# EasyEDA Pro project ProPrj_Smart_security_2024-12-20.epro

# Schematic Schematic1
Board Name: Board1; Create Date: 2024-12-19
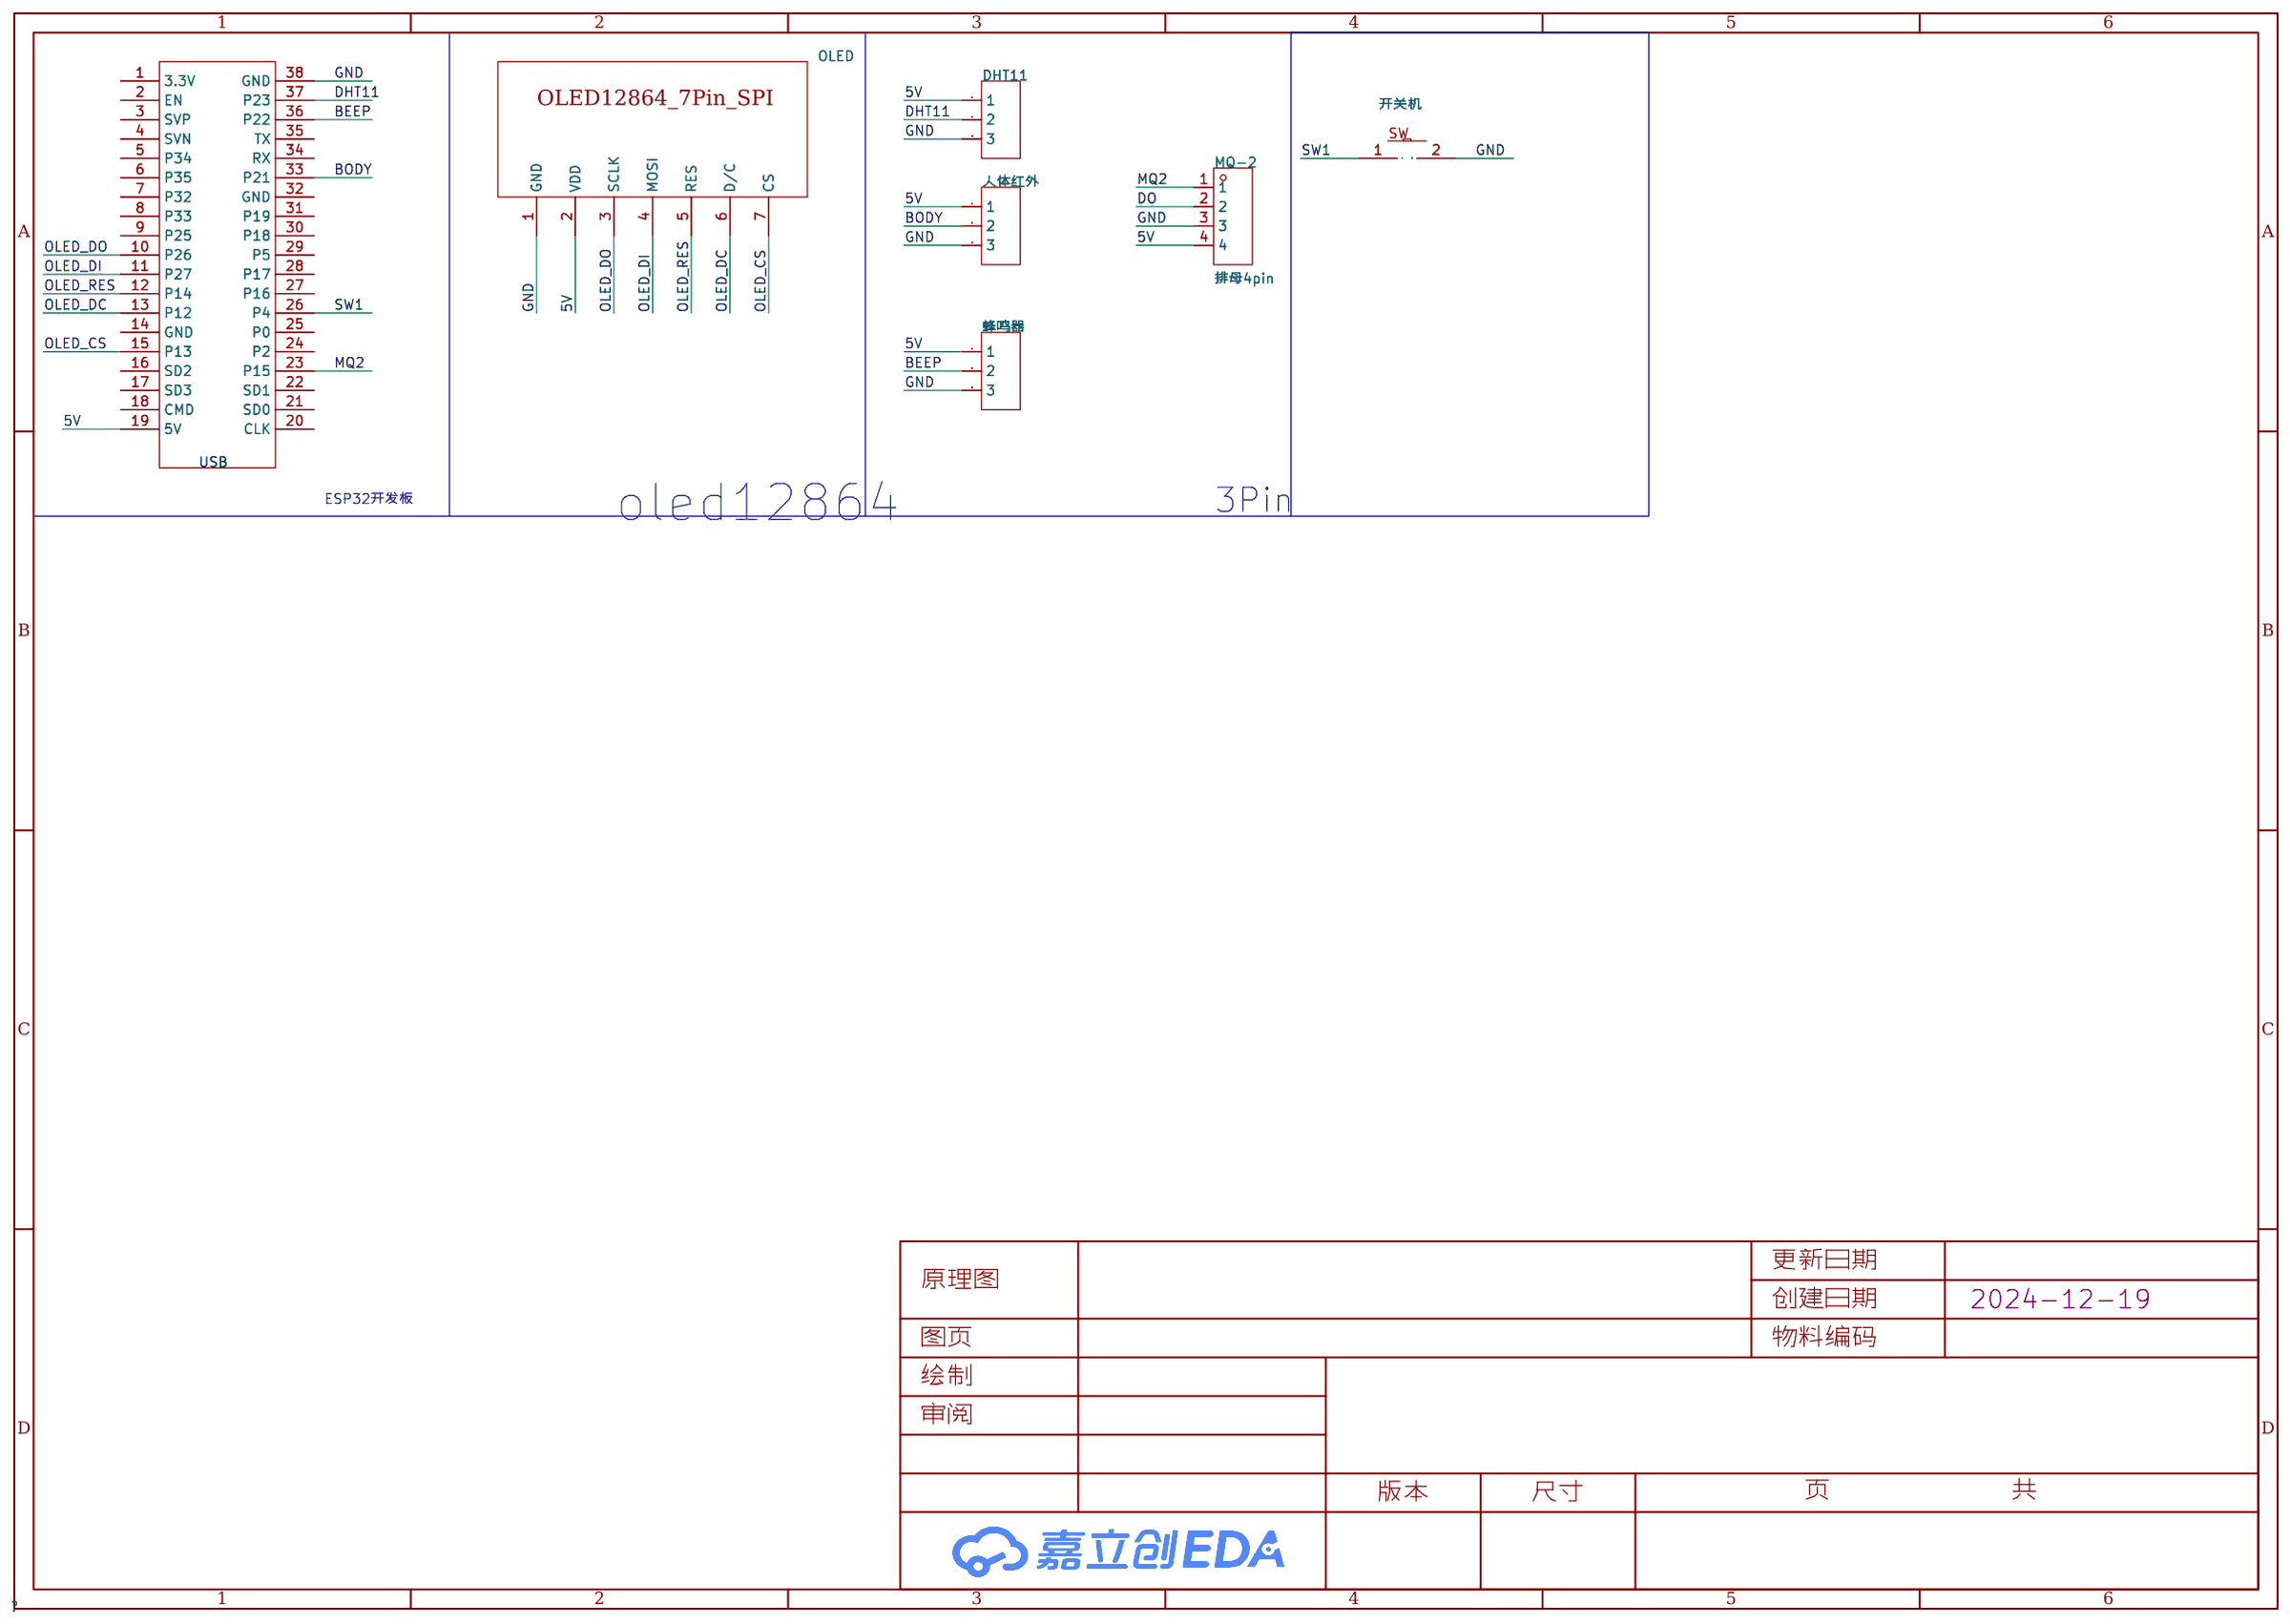
[diagram p0: schematic sheet]

## Parts
DHT11  DHT11  [HDR-F-2.54_1X3]
ESP32_38PIN_1  -  [ESP32_38PIN教学]
MQ-2  排母4pin  [排母4PIN]
OLED  OLED12864_7Pin_SPI  [OLED-12864(7PIN-SPI)]
人体红外  人体红外  [HDR-F-2.54_1X3]
开关机  -  [pb]
蜂鸣器  蜂鸣器  [HDR-F-2.54_1X3]

## Library data of the parts
DHT11 人体红外 蜂鸣器 = 排母3PIN: 3DModel: HDR-F-2.54_1x3; link: https://www.cjt.com/Upload/A2541.pdf; Supplier Part: C146690; Supplier: LCSC
ESP32_38PIN_1 = ESP32_38PIN
MQ-2 = 排母4pin
OLED = OLED12864_7Pin_SPI: Supplier Part: undefined
开关机 = 按键

## Nets
5V: DHT11.1 ESP32_38PIN_1.19(5V) MQ-2.4 OLED.2(VDD) 人体红外.1 蜂鸣器.1
GND: DHT11.3 ESP32_38PIN_1.38(GND) MQ-2.3 OLED.1(GND) 人体红外.3 开关机.2 蜂鸣器.3
BEEP: ESP32_38PIN_1.36(P22) 蜂鸣器.2
BODY: ESP32_38PIN_1.33(P21) 人体红外.2
DHT11: DHT11.2 ESP32_38PIN_1.37(P23)
DO: MQ-2.2
MQ2: ESP32_38PIN_1.23(P15) MQ-2.1
OLED_CS: ESP32_38PIN_1.15(P13) OLED.7(CS)
OLED_DC: ESP32_38PIN_1.13(P12) OLED.6(D/C)
OLED_DI: ESP32_38PIN_1.11(P27) OLED.4(MOSI)
OLED_DO: ESP32_38PIN_1.10(P26) OLED.3(SCLK)
OLED_RES: ESP32_38PIN_1.12(P14) OLED.5(RES)
SW1: ESP32_38PIN_1.26(P4) 开关机.1

Not connected (* = marked no-connect by the designer): ESP32_38PIN_1 1(3.3V) 2(EN) 3(SVP) 4(SVN) 5(P34) 6(P35) 7(P32) 8(P33) 9(P25) 14(GND) 16(SD2) 17(SD3) 18(CMD) 20(CLK) 21(SD0) 22(SD1) 24(P2) 25(P0) 27(P16) 28(P17) 29(P5) 30(P18) 31(P19) 32(GND) 34(RX) 35(TX)

## Notes on the sheet
- ESP32开发板
- oled12864
- 3Pin

# Board PCB1
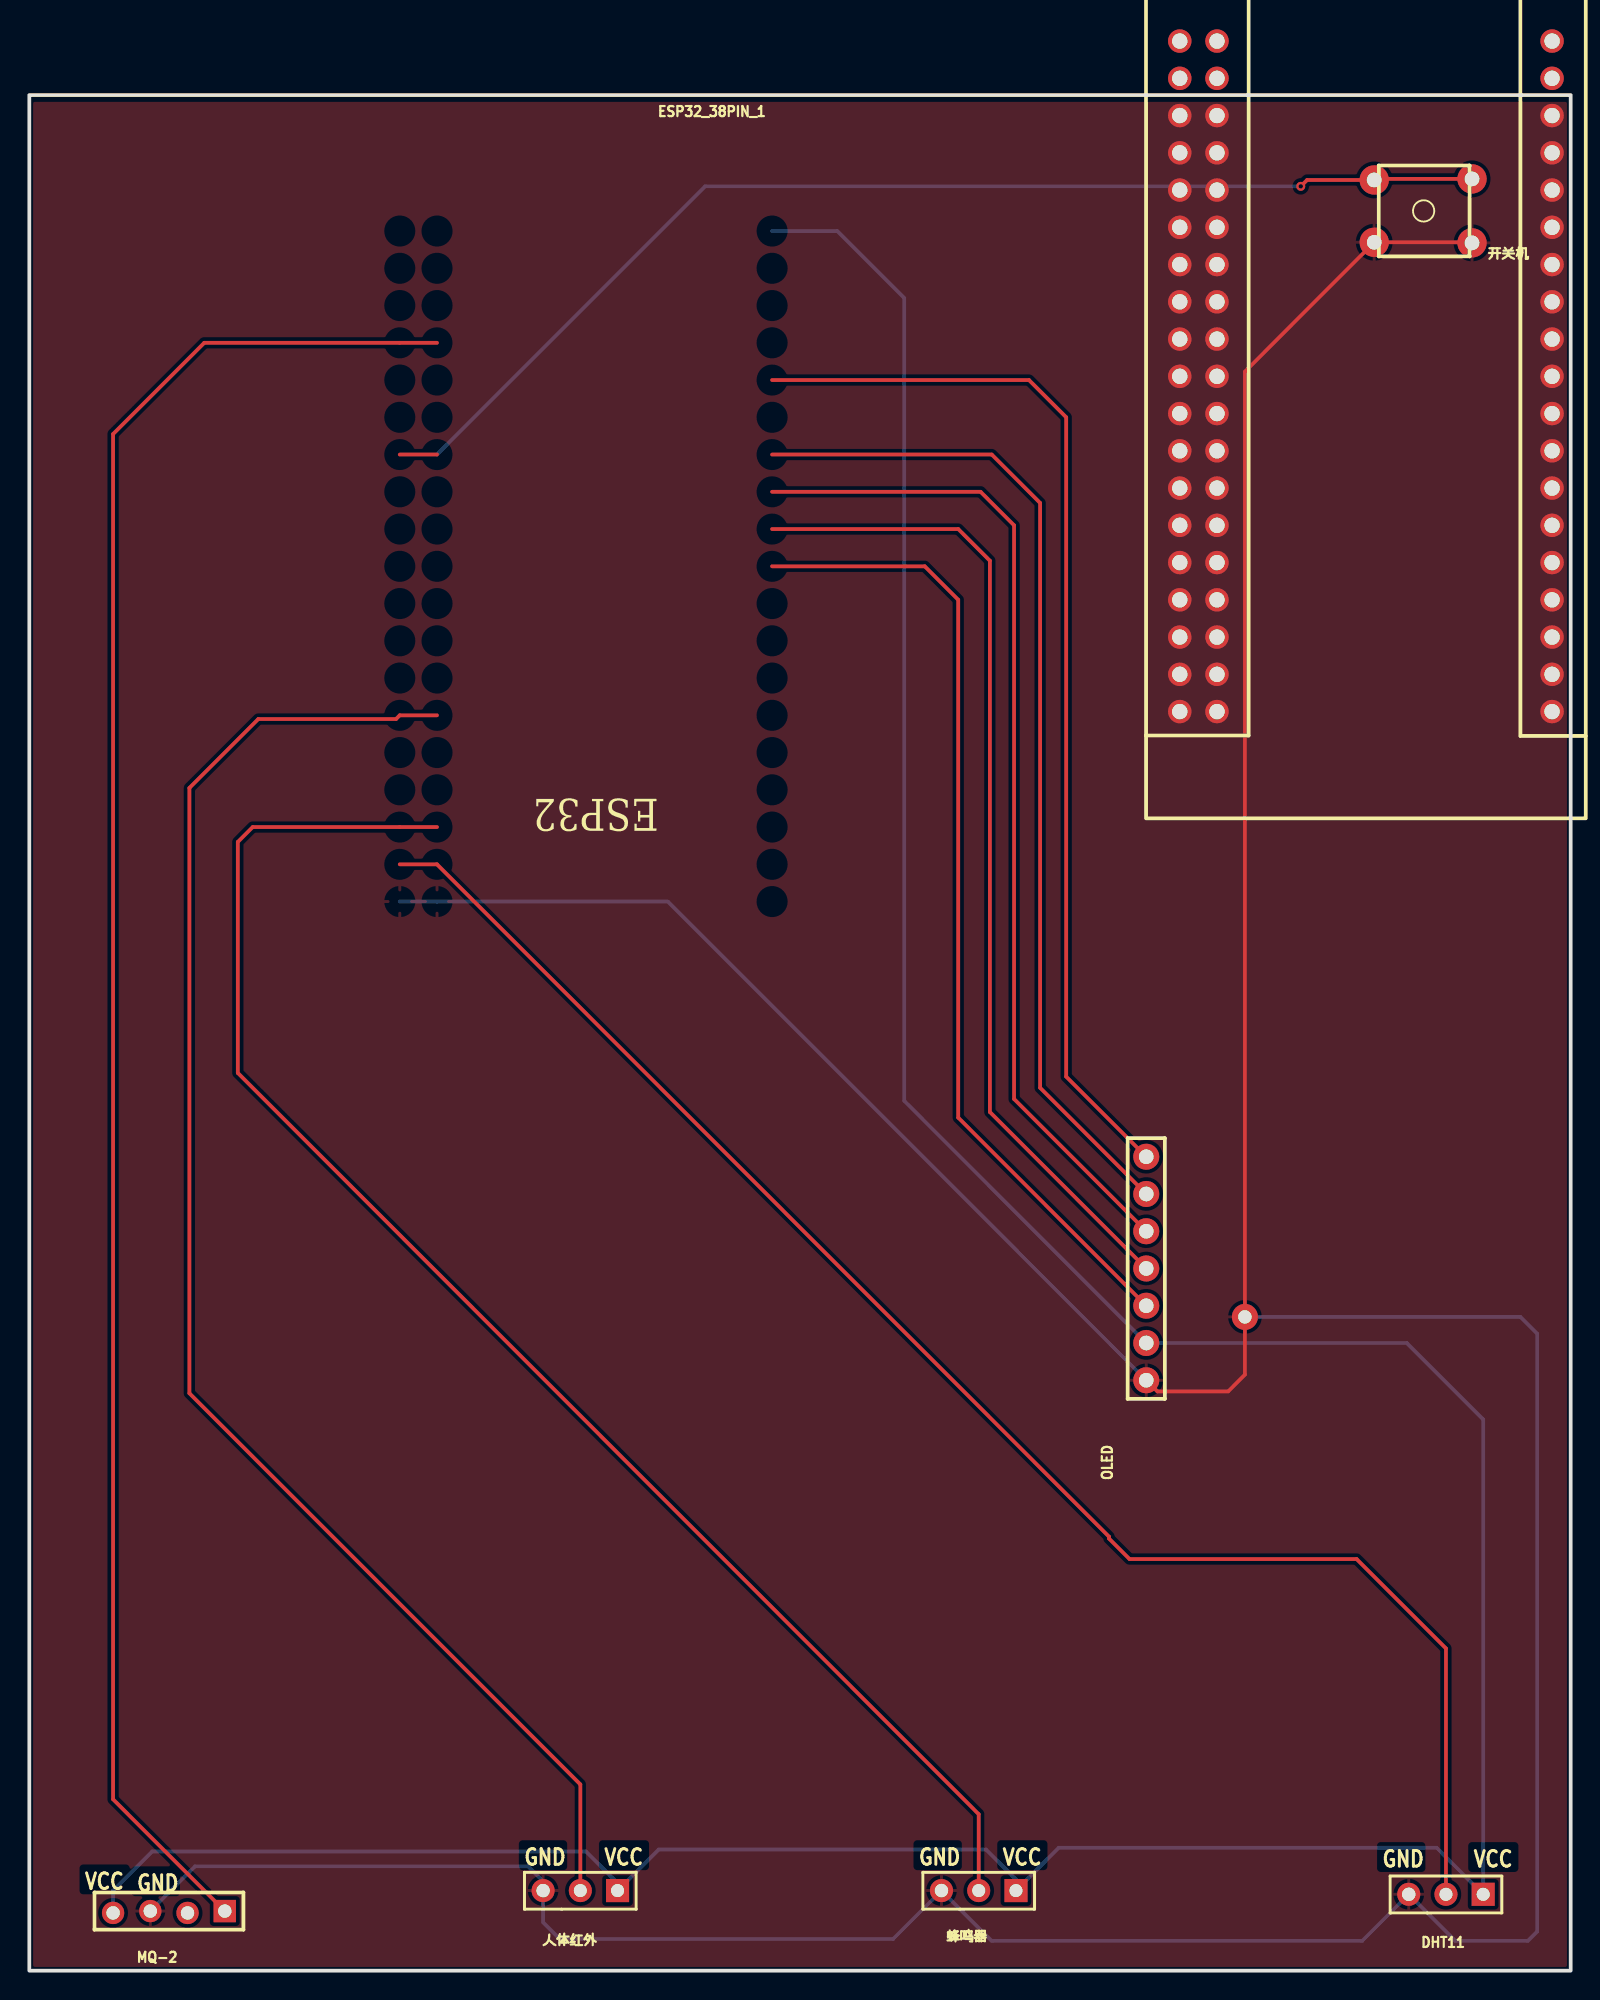
[diagram p1: board, top side]
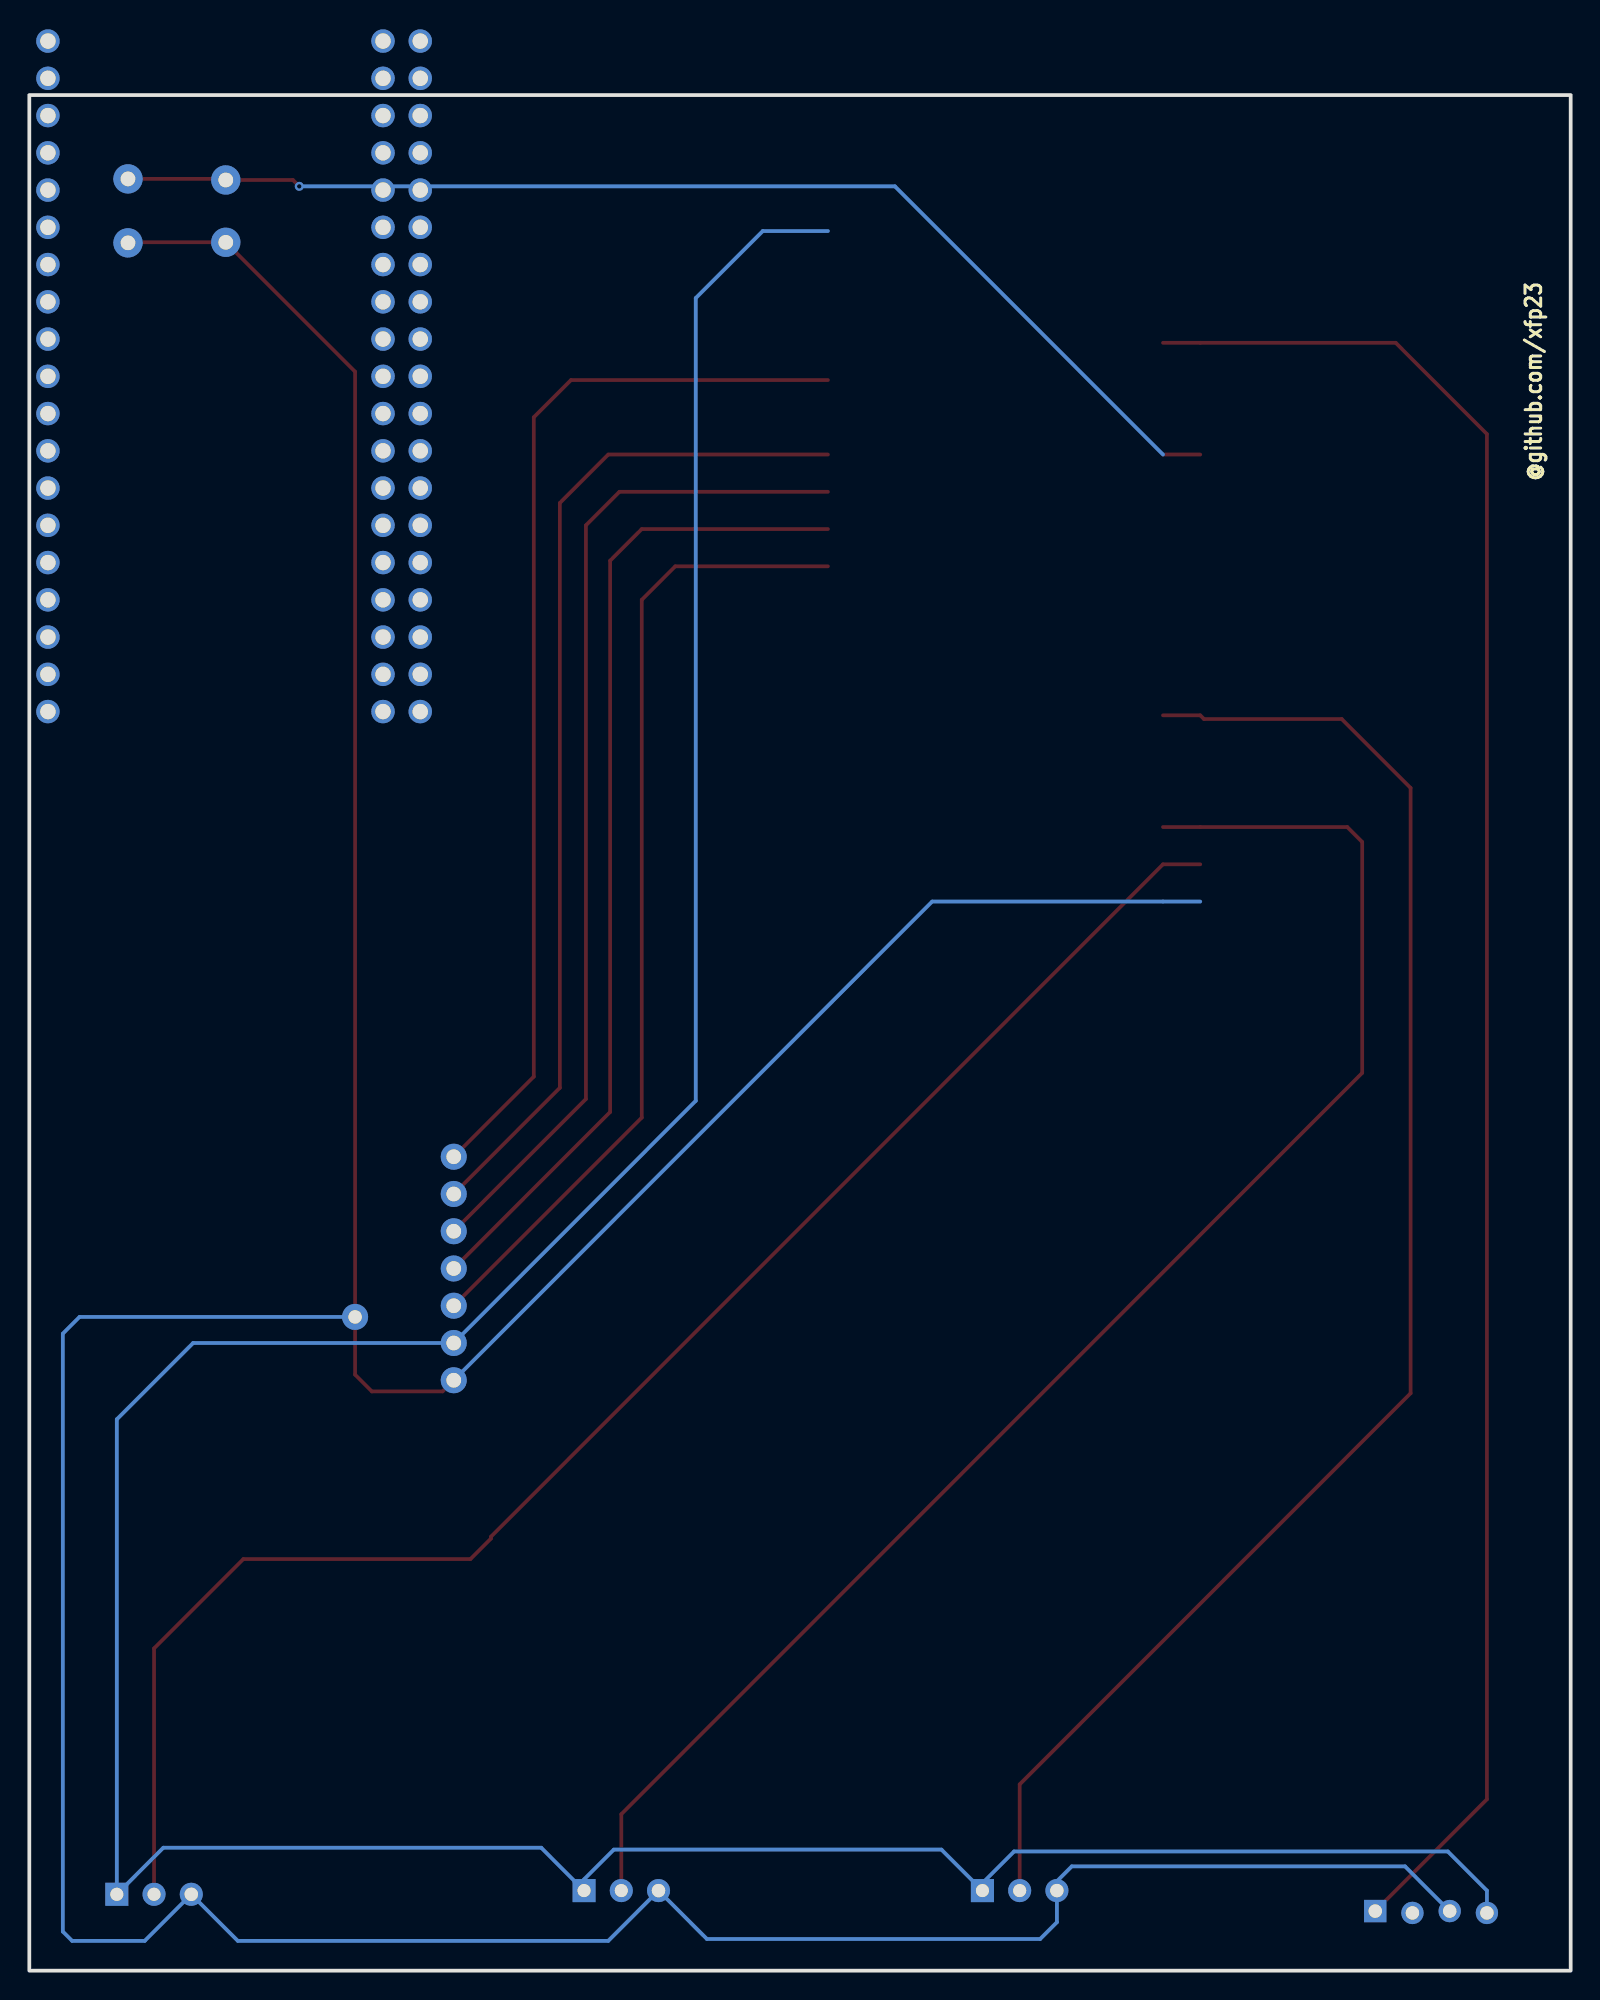
[diagram p2: board, bottom side, seen from below]

Outline 105.16 x 127.89 mm; copper layers: Top Layer, Bottom Layer. Coordinates in mm from the lower left corner of the outline.
Outline path: rectangle 0,127.89 105.16,0
Stack: Top Layer 0.035mm / Dielectric1 1.51mm FR4 er 4.5 / Bottom Layer 0.035mm

## Design rules (mm)
template: JLCPCB Capability(Two Layers Board)
spacing copperThickness1oz (default): track to track 0.102, other pairs 0.152 to 0.3
spacing copperThickness2oz: track to track 0.203, other pairs 0.152 to 0.3
track width copperThickness1oz (default): min 0.127, default 0.254, max 2.54
track width copperThickness2oz: min 0.203, default 0.254, max 2.54
differential pair differentialPair (default): width min 0.127, default 0.254, max 2.54; gap min 0.152, default 0.152
via viaSize (default): diameter min 0.5, default 0.61, max 10; hole min 0.3, default 0.305, max 6.3

## Placement (name value [footprint] x y rotation side)
DHT11  DHT11  [HDR-F-2.54_1X3]  96.65 5.21 180 top
ESP32_38PIN_1  -  [ESP32_38PIN教学]  50.67 118.62 180 top
MQ-2  排母4pin  [排母4PIN]  14.61 5.33 270 top
NOREF  -  [Pad_e255]  82.93 44.58 0 top
OLED  OLED12864_7Pin_SPI  [OLED-12864(7PIN-SPI)]  76.2 47.88 90 top
人体红外  人体红外  [HDR-F-2.54_1X3]  37.59 5.46 180 top
开关机  -  [pb]  95.12 120.02 180 top
蜂鸣器  蜂鸣器  [HDR-F-2.54_1X3]  64.77 5.46 180 top

## Footprints (pads in the part's own frame, mm; a bottom-side part is the same pattern mirrored in y, then rotated)
ESP32_38PIN教学
  round 1.6 hole 1.05: 1(-53.213,32.766) 2(-53.213,30.226) 3(-53.213,27.686) 4(-53.213,25.146) 5(-53.213,22.606) 6(-53.213,20.066) 7(-53.213,17.526) 8(-53.213,14.986) 9(-53.213,12.446) 10(-53.213,9.906) 11(-53.213,7.366) 12(-53.213,4.826) 13(-53.213,2.286) 14(-53.213,-0.254) 15(-53.213,-2.794) 16(-53.213,-5.334) 17(-53.213,-7.874) 18(-53.213,-10.414) 19(-53.213,-12.954) 20(-30.353,-12.954) 20(-27.813,-12.954) 21(-30.353,-10.414) 21(-27.813,-10.414) 22(-30.353,-7.874) 22(-27.813,-7.874) 23(-30.353,-5.334) 23(-27.813,-5.334) 24(-30.353,-2.794) 24(-27.813,-2.794) 25(-30.353,-0.254) 25(-27.813,-0.254) 26(-30.353,2.286) 26(-27.813,2.286) 27(-30.353,4.826) 27(-27.813,4.826) 28(-30.353,7.366) 28(-27.813,7.366) 29(-30.353,9.906) 29(-27.813,9.906) 30(-30.353,12.446) 30(-27.813,12.446) 31(-30.353,14.986) 31(-27.813,14.986) 32(-30.353,17.526) 32(-27.813,17.526) 33(-30.353,20.066) 33(-27.813,20.066) 34(-30.353,22.606) 34(-27.813,22.606) 35(-30.353,25.146) 35(-27.813,25.146) 36(-30.353,27.686) 36(-27.813,27.686) 37(-30.353,30.226) 37(-27.813,30.226) 38(-30.353,32.766) 38(-27.813,32.766)
HDR-F-2.54_1X3
  rect 1.575x1.575 hole 0.889: 1(-2.54,0)
  round 1.575 hole 0.889: 2(0,0)
  round 1.575 hole 0.914: 3(2.54,0)
OLED-12864(7PIN-SPI)
  round 1.778 hole 1.001: 1(-7.62,0) 2(-5.08,0) 3(-2.54,0) 4(0,0) 5(2.54,0) 6(5.08,0) 7(7.62,0)
Pad_e255
  round 1.778 hole 0.914: 1(0,0)
pb
  round 2 hole 1: 1(-3.302,-2.159) 2(-3.302,2.202) 2(3.37,2.164)
  round 2 hole 1.005x1: 1(3.37,-2.086)
排母4PIN
  rect 1.524x1.524 hole 0.914: 1(1.27,-1.27)
  round 1.524 hole 0.914: 2(1.397,-3.81) 3(1.27,-6.35) 4(1.397,-8.89)

## Nets
As in the schematic, except:
GND: DHT11.3 ESP32_38PIN_1.38 MQ-2.3 NOREF.1 OLED.1 人体红外.3 开关机.2 蜂鸣器.3

Pads without a net: ESP32_38PIN_1 1 2 3 4 5 6 7 8 9 14 16 17 18 20 21 22 24 25 27 28 29 30 31 32 34 35

## Via types
v1: diameter 0.61, hole 0.305, Top Layer to Bottom Layer, 1 via

## Routing (per net, layer and track width the routed paths; a pad name or vN(x,y) marks a point on that pad's centre or on a via; arc(x,y) is an arc through that point)
5V: length 249.3
  Bottom Layer w0.254: 50.67,118.62 55.12,118.62 59.69,114.05 59.69,59.31 OLED.2 93.98,42.8 99.19,37.59 99.19,5.21 96.01,8.38 70.23,8.38 蜂鸣器.1 67.31,6.22 65.28,8.25 42.93,8.25 人体红外.1 40.13,5.97 37.97,8.13 8.38,8.13 5.72,5.46 MQ-2.4
GND: length 325.9
  Top Layer w0.254: OLED.1 76.96,39.5 81.79,39.5 82.93,40.64 NOREF.1 82.93,109.03 开关机.2 98.39,117.85 开关机.2
  Bottom Layer w0.254: MQ-2.3 11.3,7.11 34.04,7.11 35.05,6.1 人体红外.3 35.05,3.3 36.19,2.16 58.93,2.16 蜂鸣器.3 65.66,2.03 90.93,2.03 DHT11.3 97.28,2.03 102.24,2.03 102.87,2.67 102.87,43.43 101.73,44.58 NOREF.1 ; OLED.1 43.56,72.9 25.27,72.9
BEEP: length 106.4
  Top Layer w0.254: 蜂鸣器.2 64.77,10.67 14.22,61.21 14.22,76.96 15.24,77.98 27.81,77.98
BODY: length 105.2
  Top Layer w0.254: 27.81,85.6 25.27,85.6 25.02,85.34 15.62,85.34 10.92,80.64 10.92,39.37 37.59,12.7 人体红外.2
DHT11: length 110.4
  Top Layer w0.254: DHT11.2 96.65,21.97 90.55,28.07 75.06,28.07 73.66,29.46 73.66,29.59 27.81,75.44 25.27,75.44
MQ2: length 128.5
  Top Layer w0.254: MQ-2.1 5.72,11.68 5.72,104.78 11.94,111 27.81,111
OLED_CS: length 73.8
  Top Layer w0.254: 50.67,108.46 68.2,108.46 70.74,105.92 70.74,60.96 OLED.7
OLED_DC: length 69.8
  Top Layer w0.254: OLED.6 68.96,60.2 68.96,100.08 65.66,103.38 50.67,103.38
OLED_DI: length 68.4
  Top Layer w0.254: 50.67,98.3 63.37,98.3 65.53,96.14 65.53,58.55 OLED.4
OLED_DO: length 67.1
  Top Layer w0.254: 50.67,95.76 61.09,95.76 63.37,93.47 63.37,58.17 OLED.3
OLED_RES: length 69.3
  Top Layer w0.254: OLED.5 67.18,59.44 67.18,98.55 64.9,100.84 50.67,100.84
SW1: length 80.9
  Top Layer w0.254: 27.81,103.38 25.27,103.38 ; v1(86.74,121.67) 87.18,122.1 开关机.1 91.83,122.17 开关机.1
  Bottom Layer w0.254: v1(86.74,121.67) 46.1,121.67 27.81,103.38

## Copper pours and planes (outline as drawn; the poured copper is in the pictures)
GND on Top Layer: 0,127.42 105.16,127.42 105.16,-0.52 0,-0.52

## Text on the board
Bottom Silkscreen Layer: @github.com/xfp23
Top Silkscreen Layer: GND | VCC | ESP32
